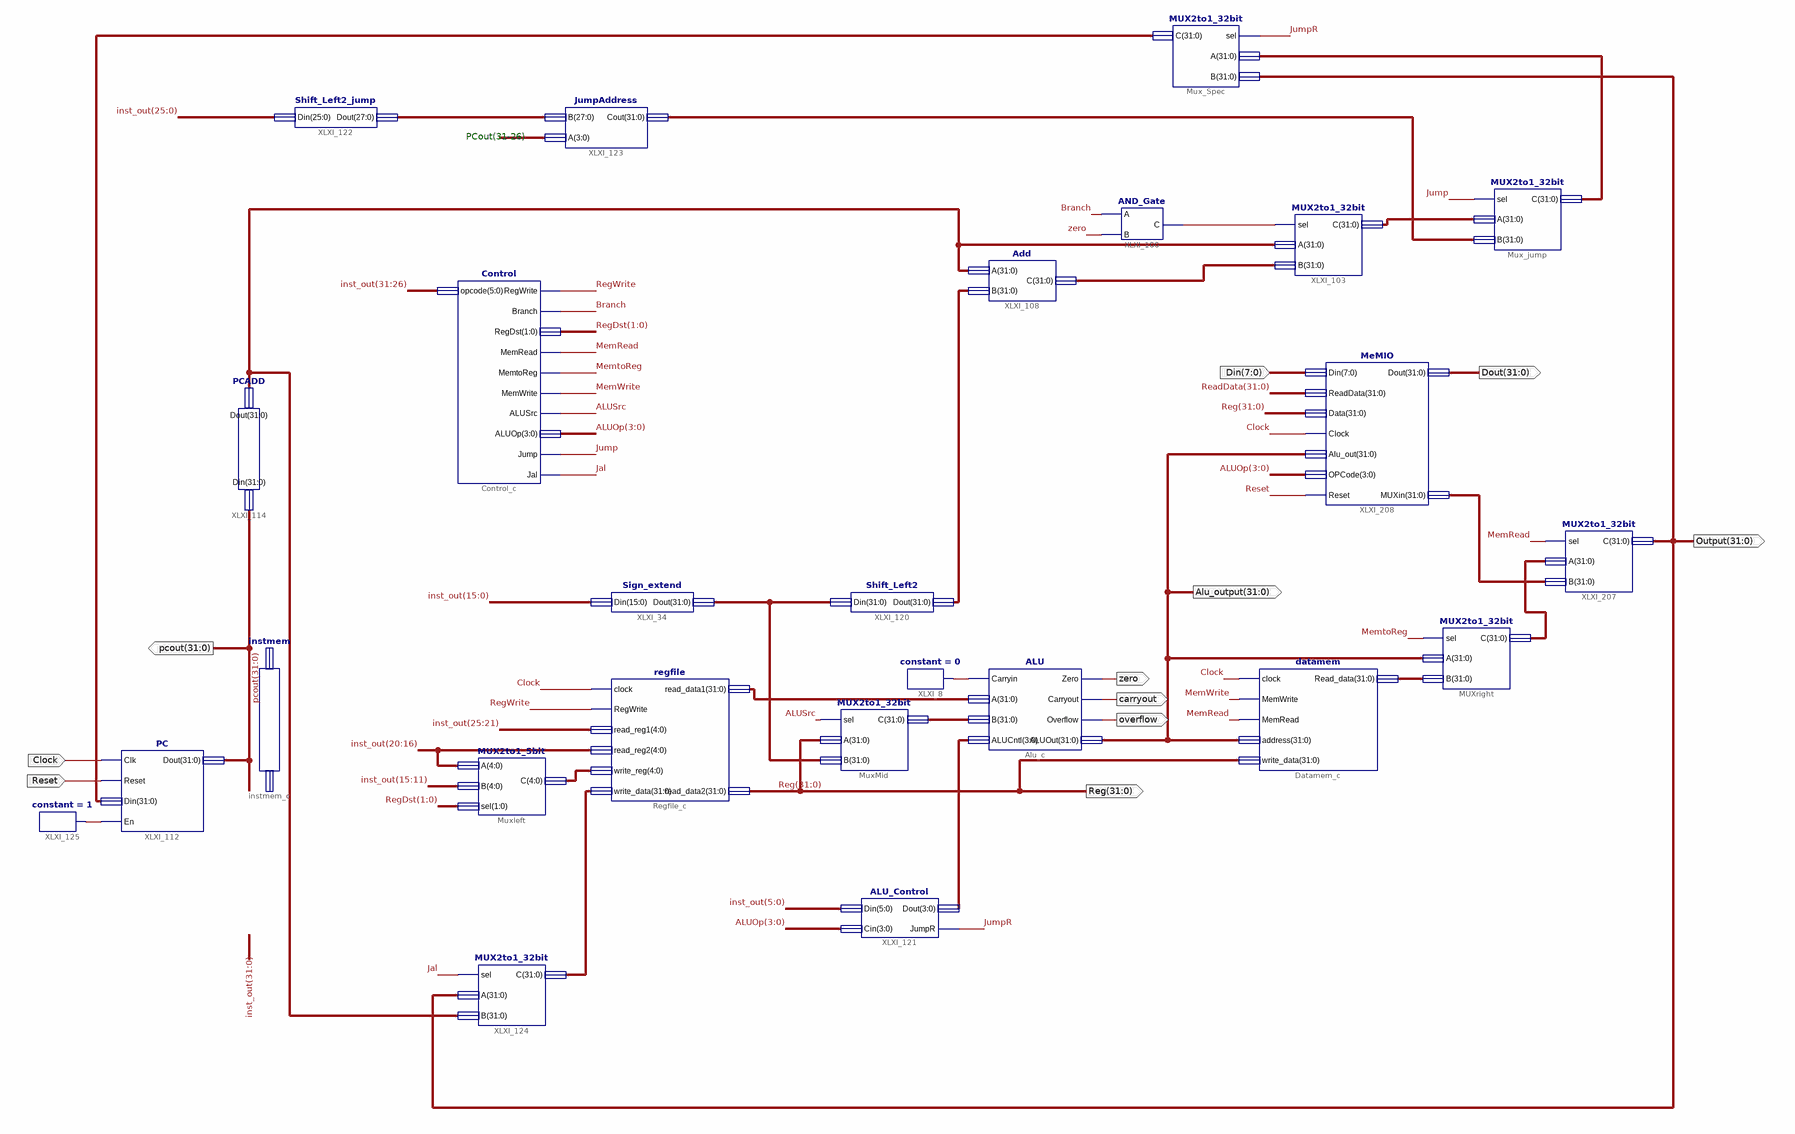
[diagram p0: schematic sheet 1]
// Xilinx ISE schematic Datapath.sch (spartan3e) as structural Verilog: 25 symbols, 11 ports
module Datapath (
  input  Reset,
  input  Clock,
  input  [7:0] Din,
  output carryout,
  output zero,
  output overflow,
  output [31:0] Reg,
  output [31:0] pcout,
  output [31:0] Dout,
  output [31:0] Alu_output,
  output [31:0] Output
);

  wire ALUSrc, Branch, Jal, Jump, JumpR, MemRead, MemtoReg, MemWrite, RegWrite, XLXN_20, XLXN_791, XLXN_922;
  wire [1:0] RegDst;
  wire [3:0] ALUOp, XLXN_817;
  wire [4:0] XLXN_156;
  wire [27:0] XLXN_834;
  wire [31:0] inst_out, ReadData, XLXN_467, XLXN_469, XLXN_759, XLXN_765, XLXN_766, XLXN_825, XLXN_828,
       XLXN_832, XLXN_837, XLXN_920, XLXN_921, XLXN_1022, XLXN_1056;

  PCADD XLXI_114 (.Din(pcout), .Dout(XLXN_837));
  PC XLXI_112 (.Clk(Clock), .Reset(Reset), .En(XLXN_922), .Din(XLXN_920), .Dout(pcout));
  ALU_Control XLXI_121 (.Din(inst_out[5:0]), .Cin(ALUOp), .JumpR(JumpR), .Dout(XLXN_817));
  instmem instmem_c (.read_inst(pcout), .inst_out(inst_out));
  constant #(.CValue("1")) XLXI_125 (.O(XLXN_922));
  MUX2to1_32bit XLXI_124 (.sel(Jal), .A(Output), .B(XLXN_837), .C(XLXN_825));
  MUX2to1_5bit Muxleft (.A(inst_out[20:16]), .B(inst_out[15:11]), .sel(RegDst), .C(XLXN_156));
  regfile Regfile_c (
    .clock(Clock), .RegWrite(RegWrite), .read_reg1(inst_out[25:21]), .read_reg2(inst_out[20:16]),
    .write_reg(XLXN_156), .write_data(XLXN_825), .read_data1(XLXN_467), .read_data2(Reg));
  Sign_extend XLXI_34 (.Din(inst_out[15:0]), .Dout(XLXN_1022));
  ALU Alu_c (
    .Carryin(XLXN_20), .A(XLXN_467), .B(XLXN_469), .ALUCntl(XLXN_817), .Zero(zero), .Carryout(carryout),
    .Overflow(overflow), .ALUOut(Alu_output));
  MUX2to1_32bit MuxMid (.sel(ALUSrc), .A(Reg), .B(XLXN_1022), .C(XLXN_469));
  constant #(.CValue("0")) XLXI_8 (.O(XLXN_20));
  Shift_Left2 XLXI_120 (.Din(XLXN_1022), .Dout(XLXN_759));
  MUX2to1_32bit Mux_Spec (.sel(JumpR), .A(XLXN_766), .B(Output), .C(XLXN_920));
  JumpAddress XLXI_123 (.B(XLXN_834), .A(XLXN_837[31:28]), .Cout(XLXN_832));
  Shift_Left2_jump XLXI_122 (.Din(inst_out[25:0]), .Dout(XLXN_834));
  Control Control_c (
    .opcode(inst_out[31:26]), .Jump(Jump), .Jal(Jal), .RegWrite(RegWrite), .Branch(Branch),
    .MemRead(MemRead), .MemtoReg(MemtoReg), .MemWrite(MemWrite), .ALUSrc(ALUSrc), .ALUOp(ALUOp),
    .RegDst(RegDst));
  MUX2to1_32bit XLXI_103 (.sel(XLXN_791), .A(XLXN_837), .B(XLXN_765), .C(XLXN_828));
  AND_Gate XLXI_100 (.A(Branch), .B(zero), .C(XLXN_791));
  Add XLXI_108 (.A(XLXN_837), .B(XLXN_759), .C(XLXN_765));
  MUX2to1_32bit Mux_jump (.sel(Jump), .A(XLXN_828), .B(XLXN_832), .C(XLXN_766));
  MUX2to1_32bit XLXI_207 (.sel(MemRead), .A(XLXN_921), .B(XLXN_1056), .C(Output));
  MeMIO XLXI_208 (
    .Din(Din), .ReadData(ReadData), .Data(Reg), .Clock(Clock), .Alu_out(Alu_output), .OPCode(ALUOp),
    .Reset(Reset), .Dout(Dout), .MUXin(XLXN_1056));
  datamem Datamem_c (
    .clock(Clock), .MemWrite(MemWrite), .MemRead(MemRead), .address(Alu_output), .write_data(Reg),
    .Read_data(ReadData));
  MUX2to1_32bit MUXright (.sel(MemtoReg), .A(Alu_output), .B(ReadData), .C(XLXN_921));

  // Notes on the sheet:
  //   PCout(31-26)
endmodule
